# Altium project Robot_Timer_PCB.PrjPcb
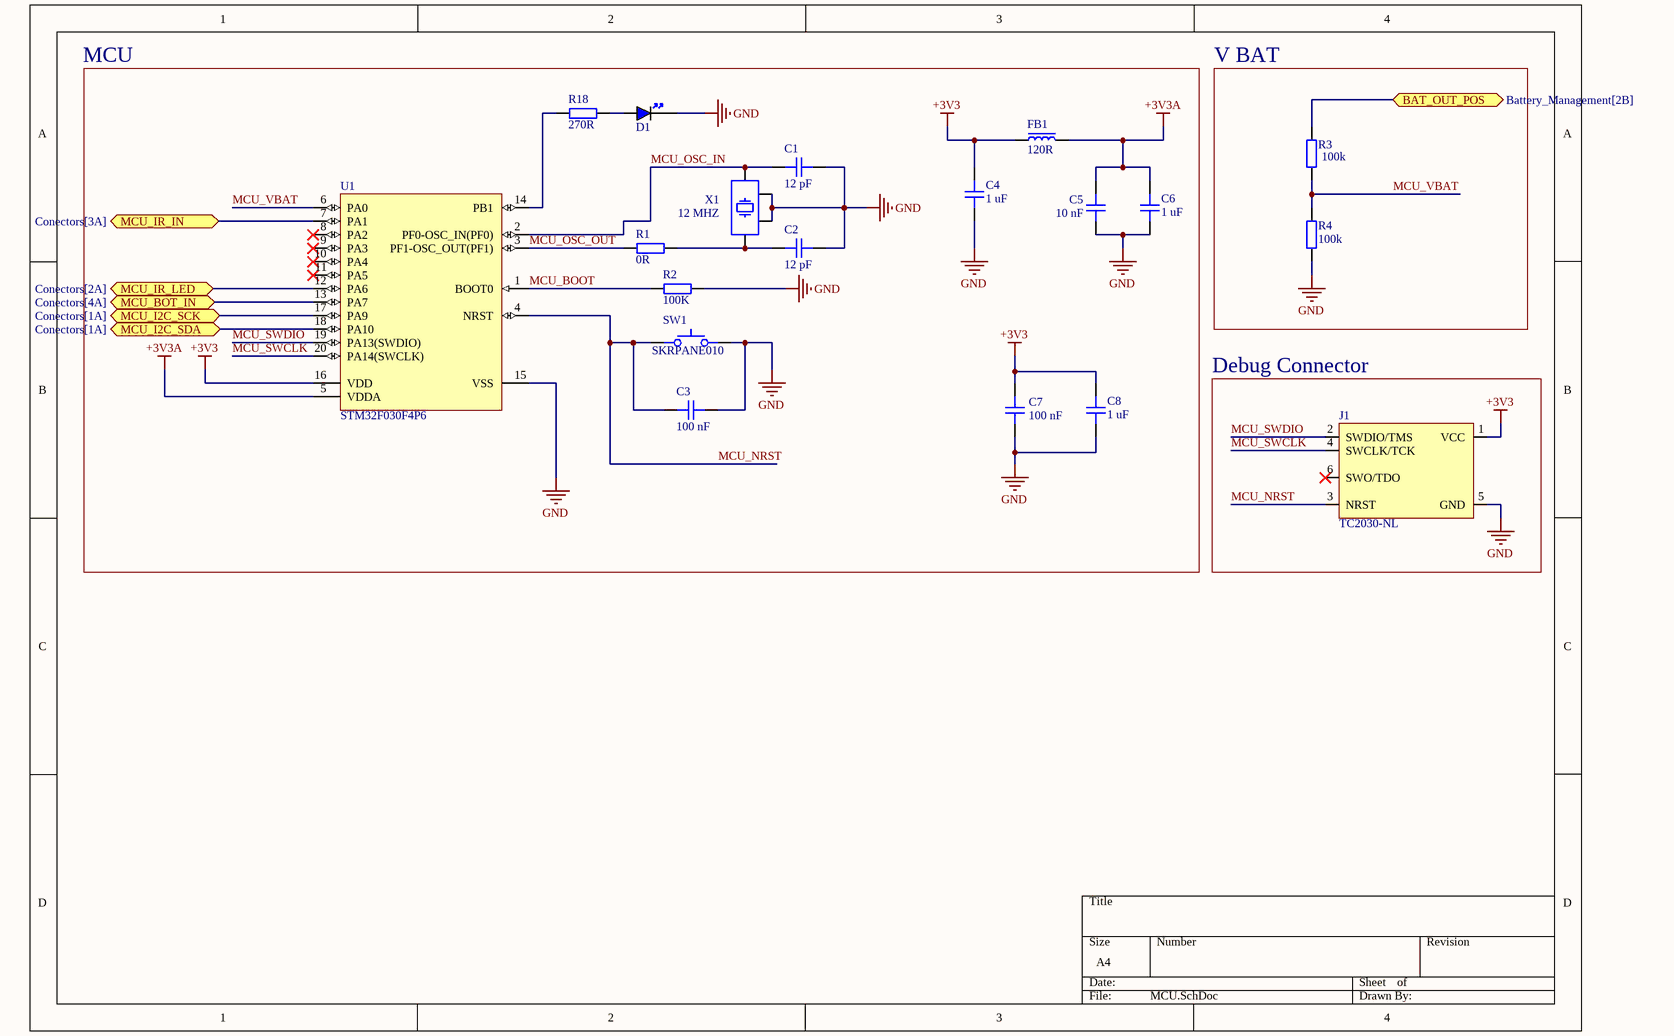
[diagram p0: MCU.SchDoc]
3 sheets, 59 parts. Net scope: flat (ports and power ports of the same name join across sheets).
Board files: PCB1.PcbDoc, PCB2.PcbDoc
Sheets:
  MCU.SchDoc
  Battery_Management.SchDoc
  Conectors.SchDoc

## Sheet MCU.SchDoc
size A4; SheetNumber: 1; SheetTotal: 3

### Parts
C1  12 pF  [CAP_0402]
C2  12 pF  [CAP_0402]
C3  100 nF  [CAP_0402]
C4  1 uF  [CAP_0805]
C5  10 nF  [CAP_0402]
C6  1 uF  [CAP_0805]
C7  100 nF  [CAP_0402]
C8  1 uF  [CAP_0805]
D1  BLUE  [LED_0805_BLUE]  (value not drawn)
FB1  120R  [FB_0805]
J1  TC2030-NL  [TC2030-NL-FP]  (no BOM)
R1  0R  [RES_0402]
R2  100K  [RES_0402]
R3  100k  [RES_0603]
R4  100k  [RES_0603]
R18  270R  [RES_0402]
SW1  SKRPANE010  [SKRPANE010]
U1  STM32F030F4P6  [STM-TSSOP20_L]
X1  12 MHZ  [XTAL_2520]

### Blocks framed on the sheet
MCU: C1-C8 D1 FB1 R1 R2 R18 SW1 U1 X1
V BAT: R3 R4
Debug Connector: J1

### Ports
BAT_OUT_POS (bidir, see Battery_Management[2B]), MCU_BOT_IN (bidir, see Conectors[4A]), MCU_I2C_SCK (bidir, see Conectors[1A]), MCU_I2C_SDA (bidir, see Conectors[1A]), MCU_IR_IN (bidir, see Conectors[3A]), MCU_IR_LED (bidir, see Conectors[2A])

### Nets
+3V3: C4.2 C7.2 C8.2 FB1.1 J1.1(VCC) U1.16(VDD)
+3V3A: C5.2 C6.2 FB1.2 U1.5(VDDA)
GND: C1.2 C2.2 C3.2 C4.1 C5.1 C6.1 C7.1 C8.1 D1.K J1.5(GND) R2.2 R4.1 SW1.34 U1.15(VSS) X1.2 X1.4
MCU_BOOT: R2.1 U1.1(BOOT0)
MCU_I2C_SDA: U1.18(PA10) ; port MCU_I2C_SDA
MCU_NRST: C3.1 J1.3(NRST) SW1.12 U1.4(NRST)
MCU_OSC_IN: C1.1 U1.2(PF0-OSC_IN(PF0)) X1.3
MCU_OSC_OUT: R1.1 U1.3(PF1-OSC_OUT(PF1))
MCU_SWCLK: J1.4(SWCLK/TCK) U1.20(PA14(SWCLK))
MCU_SWDIO: J1.2(SWDIO/TMS) U1.19(PA13(SWDIO))
MCU_VBAT: R3.1 R4.2 U1.6(PA0)
NetC2_1: C2.1 R1.2 X1.1
NetC11_1: R3.2 ; port BAT_OUT_POS
NetD1_A: D1.A R18.2
NetJ6_1: U1.13(PA7) ; port MCU_BOT_IN
NetP1_2: U1.17(PA9) ; port MCU_I2C_SCK
NetP2_3: U1.7(PA1) ; port MCU_IR_IN
NetR16_1: U1.12(PA6) ; port MCU_IR_LED
NetR18_1: R18.1 U1.14(PB1)

Not connected (* = marked no-connect by the designer): J1 6(SWO/TDO)*; U1 8(PA2)* 9(PA3)* 10(PA4)* 11(PA5)*

### Notes on the sheet
- THIS DOCUMENT AND THE DATA DISCLOSED HEREIN OR
- HEREWITH IS THE PROPERTY OF ALTIUM LIMITED AND MAY
- DWG NO:
- REVISION
- REV:
- DESCRIPTION
- DATE
- APPROVED
- BE FREELY DISTRIBUTED IN WHOLE. NO RIGHTS ARE
- RESERVED OR EXPRESS OR IMPLIED WARANTEE GIVEN.
- ENG:
- APPROVALS
- PROJECT
- DSN:
- CHK:
- REFERENCE DOCUMENTS
- PROJECT REVISION:
- TITLE
- DOCUMENT REVISION:
- DESIGN ITEM:
- BOM:
- FAB DWG:
- PCB DWG:
- ASSY DWG:
- SCALE:
- A3
- SIZE
- CAGE CODE
- FILE NAME
- DWG NO.
- SHEET
- OF
- REV

### Library data of the parts
C1-C3 C5 C7 = CAP_0402: Capacitor SMD 0402; Manufacturer: *; Manufacturer Part Number: *; Distributor Link: *; LCSC: *; Rating: *; Dielectric: *
C4 C6 C8 = CAP_0805: Capacitor SMD 0805; Manufacturer: *; Manufacturer Part Number: *; Distributor Link: *; LCSC: *; Rating: *; Dielectric: *
D1 = LED_0805_BLUE: LED 0805 BLUE SMD; Manufacturer: *; Manufacturer Part Number: *; Distributor Link: *; LCSC: *
FB1 = FB_0805: Ferrite Bead SMD 0805GZ2012D121TF; Manufacturer Part Number: PZ2012D121-3R0TF; Manufacturer: *; Distributor Link: *; LCSC: *
J1 = TC2030-NL: Tag-Connect No-Solder SWD Debug Connector (No Legs) DO NOT PLACE; Manufacturer: Tag-Connect; Manufacturer Part Number: TC2030-NL-FP
R1 R2 R18 = RES_0402: Resistor SMD 0402; Manufacturer: *; Manufacturer Part Number: *; Distributor Link: *; LCSC: *
R3 R4 = RES_0603: Resistor SMD 0603; Manufacturer: *; Manufacturer Part Number: *; Distributor Link: *; LCSC: *
SW1 = SKRPANE010: Tactile Switch SMD SPST; Manufacturer: Alps Alpine; Manufacturer Part Number: SKRPANE010
U1 = CMP-0304-00039-2: ARM Cortex-M0 32-bit MCU, 16 KB Flash, 4 KB Internal RAM, 15 I/Os, 20-pin TSSOP, -40 to 85 degC, Tube; I/Os (High Current): 15; FLASH Size (Prog) (kB): 16; Internal RAM Size (kB): 4; Supply Voltage(Vcc) min (V): 2.4; Operating Frequency(F) (Processor speed) (MHz): 48; ComponentLink2URL: http://www.st.com/st-web-ui/static/active/en/resource/technical/document/datasheet/DM00088500.pdf; Core: ARM Cortex-M0; ComponentLink2Description: Datasheet; PackageDescription: 20-Pin Thin Shrink Small Outline Package, 6.5 x 4.4 mm Body, 0.65 mm Pitch; Mounting Technology: Surface Mount; ComponentLink1URL: http://www.st.com/web/en/home.html; PackageVersion: Rev. 1, 11/2012; ComponentLink3Description: Package Specification; PartNumber: STM32F030F4P6; ComponentLink3URL: http://www.st.com/st-web-ui/static/active/en/resource/technical/document/datasheet/DM00065136.pdf; DatasheetVersion: Rev. 1; PackageReference: TSSOP20; ComponentLink1Description: Manufacturer URL; Packing: Tube
X1 = XTAL_2520: Crystal SMD 2520; Manufacturer Part Number: HY12MSMD2520FA1R30; Distributor Link: *

## Sheet Battery_Management.SchDoc
size A4; SheetNumber: 2; SheetTotal: 3
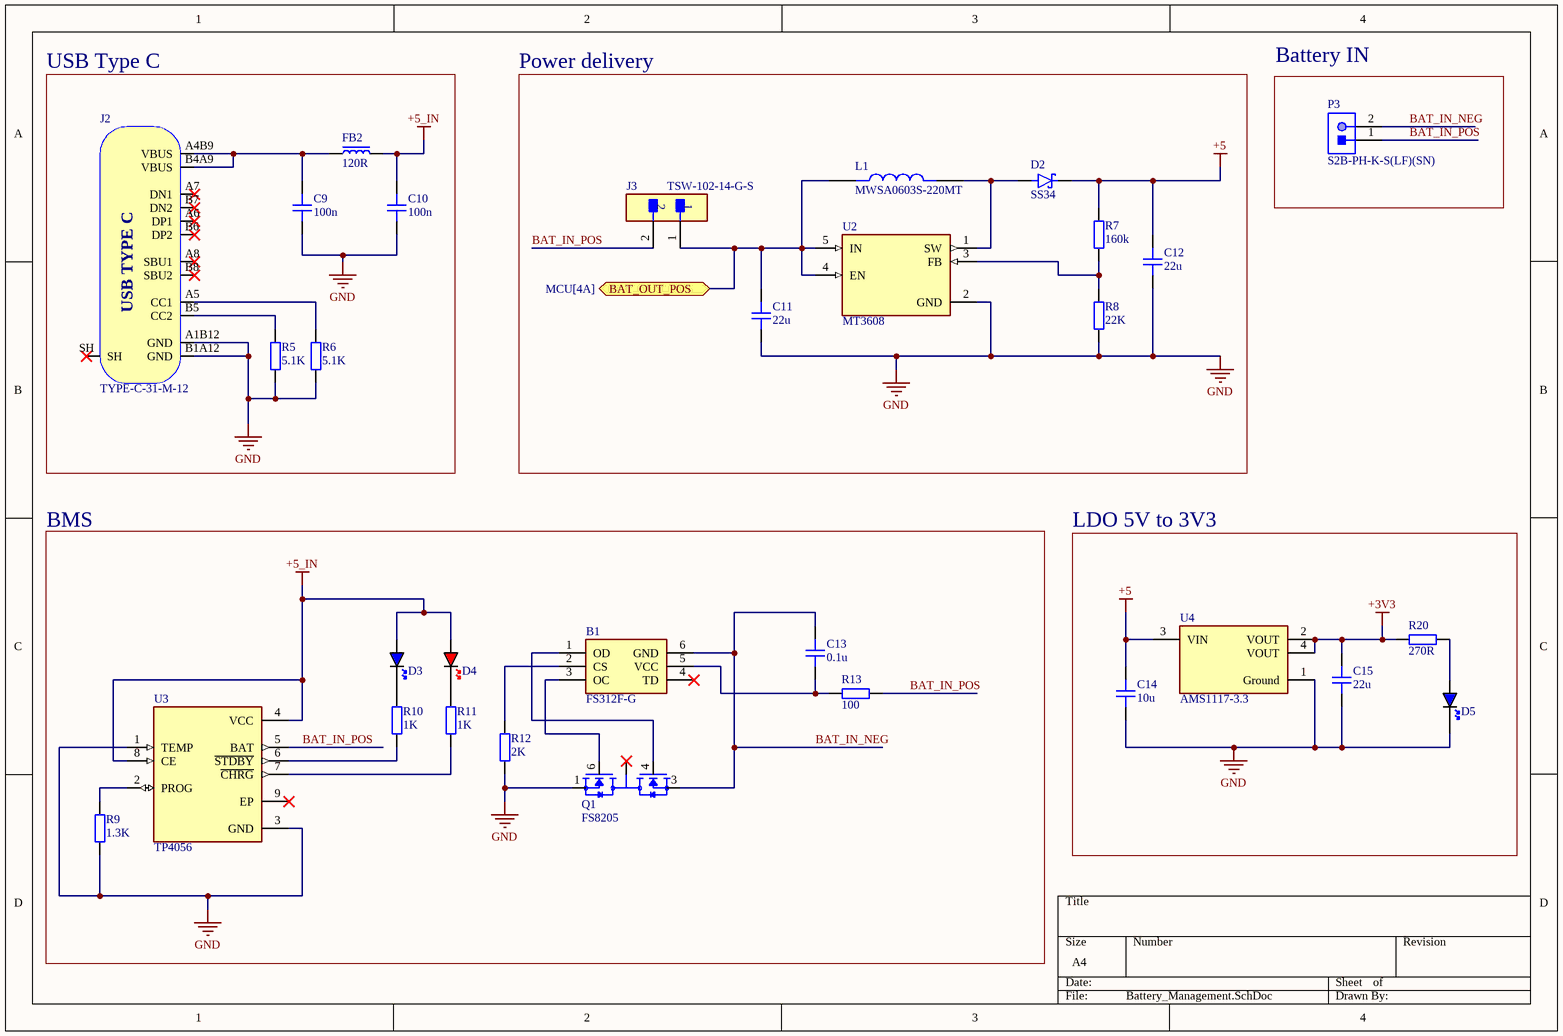
[diagram p1: Battery_Management.SchDoc]

### Parts
B1  FS312F-G  [SOT95P280X145-6N]
C9  100n  [CAP_0603]
C10  100n  [CAP_0603]
C11  22u  [CAP_0603]
C12  22u  [CAP_0603]
C13  0.1u  [CAP_0603]
C14  10u  [CAP_0805]
C15  22u  [CAP_0805]
D2  SS34  [DIO_SS34]
D3  BLUE  [LED_0603_BLUE]  (value not drawn)
D4  RED  [LED_0603_RED]  (value not drawn)
D5  BLUE  [LED_0805_BLUE]  (value not drawn)
FB2  120R  [FB_0805]
J2  TYPE-C-31-M-12  [TYPE-C-31-M-12]
J3  TSW-102-14-G-S  [FP-TSW-102-14-G-S-MFG]
L1  MWSA0603S-220MT  [INDM7066X300N]
P3  S2B-PH-K-S(LF)(SN)  [JST-S2B-PH-K-S_V]
Q1  FS8205  [SOT95P280X145-6N]
R5  5.1K  [RES_0402]
R6  5.1K  [RES_0402]
R7  160k  [RES_0603]
R8  22K  [RES_0603]
R9  1.3K  [RES_0603]
R10  1K  [RES_0603]
R11  1K  [RES_0603]
R12  2K  [RES_0603]
R13  100  [RES_0603]
R20  270R  [RES_0402]
U2  MT3608  [SOT95P280X145-6N]
U3  TP4056  [SOP127P600X175-9N]
U4  AMS1117-3.3  [FP-AMS1117-IPC_C]

### Blocks framed on the sheet
USB Type C: C9 C10 FB2 J2 R5 R6
Power delivery: C11 C12 D2 J3 L1 R7 R8 U2
Battery IN: P3
BMS: B1 C13 D3 D4 Q1 R9-R13 U3
LDO 5V to 3V3: C14 C15 D5 R20 U4

### Ports
BAT_OUT_POS (bidir, see MCU[4A])

### Nets
+3V3: C15.2 R20.1 U4.2(VOUT) U4.4(VOUT)
+5: C12.1 C14.2 D2.C(K) R7.2 U4.3(VIN)
+5_IN: C10.2 D3.A D4.A FB2.2 U3.4(VCC) U3.8(CE)
GND: C9.1 C10.1 C11.2 C12.2 C14.1 C15.1 D5.K J2.A1B12(GND) J2.B1A12(GND) Q1.1(S1) R5.1 R6.1 R8.1 R9.1 R12.1 U2.2(GND) U3.1(TEMP) U3.3(GND) U4.1(Ground)
BAT_IN_NEG: B1.6(GND) C13.1 P3.2 Q1.3(S2)
BAT_IN_POS: J3.2 P3.1 R13.2 U3.5(BAT)
NetB1_1: B1.1(OD) Q1.4(G2)
NetB1_2: B1.2(CS) R12.2
NetB1_3: B1.3(OC) Q1.6(G1)
NetB1_5: B1.5(VCC) C13.2 R13.1
NetC9_2: C9.2 FB2.1 J2.A4B9(VBUS) J2.B4A9(VBUS)
NetC11_1: C11.1 J3.1 L1.1 U2.4(EN) U2.5(IN) ; port BAT_OUT_POS
NetD2_A: D2.A L1.2 U2.1(SW)
NetD3_K: D3.K R10.2
NetD4_K: D4.K R11.2
NetD5_A: D5.A R20.2
NetJ2_A5: J2.A5(CC1) R6.2
NetJ2_B5: J2.B5(CC2) R5.2
NetQ1_2: Q1.2(D12) Q1.5(D12)
NetR7_1: R7.1 R8.2 U2.3(FB)
NetR9_2: R9.2 U3.2(PROG)
NetR10_1: R10.1 U3.6(~{STDBY})
NetR11_1: R11.1 U3.7(~{CHRG})

Not connected (* = marked no-connect by the designer): B1 4(TD)*; J2 A6(DP1)* A7(DN1)* A8(SBU1)* B6(DP2)* B7(DN2)* B8(SBU2)* SH*; U3 9(EP)*

### Notes on the sheet
- (in symbol TYPE-C-31-M-12) USB TYPE C

### Library data of the parts
B1 = FS312F-G: One Cell Lithium-ion/Polymer Battery Protection IC; Manufacturer_Name: Fortune Semiconductor Corporation; Geometry.Height: 1.45mm; Manufacturer_Part_Number: FS312F-G; Mouser Part Number: *; Mouser Price/Stock: *; Arrow Part Number: *; Arrow Price/Stock: *; Datasheet Link: https://www.ic-fortune.com/upload/Download/FS312F-G-DS-12_EN.pdf
C9-C13 = CAP_0603: Capacitor SMD 0603; Manufacturer: *; Manufacturer Part Number: *; Distributor Link: *; LCSC: *; Rating: *; Dielectric: *
C14 C15 = CAP_0805: Capacitor SMD 0805; Manufacturer: *; Manufacturer Part Number: *; Distributor Link: *; LCSC: *; Rating: *; Dielectric: *
D2 = SS34: 3A, 40V, Schottky Rectifier; MF: Taiwan Semiconductor; SnapEDA_Link: https://www.snapeda.com/parts/SS34/Taiwan+Semiconductor/view-part/?ref=snap; Package: DO-214AB-2 Taiwan Semiconductor; Value: *; MP: SS34; Check_prices: https://www.snapeda.com/parts/SS34/Taiwan+Semiconductor/view-part/?ref=eda
D3 = LED_0603_BLUE: LED 0603 BLUE SMD
D4 = LED_0603_RED: LED 0603 RED SMD
D5 = LED_0805_BLUE: LED 0805 BLUE SMD; Manufacturer: *; Manufacturer Part Number: *; Distributor Link: *; LCSC: *
FB2 = FB_0805: Ferrite Bead SMD 0805; Manufacturer Part Number: PZ2012D121-3R0TF; Manufacturer: *; Distributor Link: *; LCSC: *
J2 = TYPE-C-31-M-12: USB Type C Connector Horizontal SMT; Manufacturer: Koren Hroparts; Manufacturer Part Number: TYPE-C-31-M-12
J3 = CMP-02766-001740-1: CONN HEADER VERT 2POS 2.54MM; Number of Positions: 2; Max Current Rating: 7.6A; Gender: Male; Max Voltage Rating (AC): 550V; Contact Mating Length: 0.32inch; REACH SVHC: No SVHC; Width: 2.54mm; Insulation Material: PBT; Contact Shape: Square; Contact Plating: Gold; Min Operating Temperature: -55°C; Contact Material: Bronze; Color: Black; Number of Contacts: 2; Housing Material: Polyester; Orientation: Straight; Flammability Rating: UL94 V-0; Max Operating Temperature: 125°C; Contact Type: Male Pin; Radiation Hardening: No; Termination: Solder; RoHS Compliant: Yes; Lead Free: Lead Free; Fastening Type: Pull; Pitch: 2.54mm; Number of Rows: 1; Series: TSW; Insulation Color: Black; Package Quantity: 1; Connector Type: Header; Length: 5.08mm; Contact Finish - Mating: GOLD; Mount: Through Hole; Housing Color: Black; Depth: 2.54mm; Packaging: Bulk
L1 = MWSA0603S-220MT: 22 ÂµH Unshielded Drum Core, Wirewound Inductor 2.5 A 170mOhm Max Nonstandard -; MF: Shenzhen Sunlord Electronics Co., Ltd.; SnapEDA_Link: https://www.snapeda.com/parts/MWSA0603S-220MT/Shenzhen+Huacan+Tianlu+Electronics+Co.%252C+Ltd./view-part/?ref=snap; Package: None; Value: *; MP: MWSA0603S-220MT; Check_prices: https://www.snapeda.com/parts/MWSA0603S-220MT/Shenzhen+Huacan+Tianlu+Electronics+Co.%252C+Ltd./view-part/?ref=eda
P3 = CMP-1755-00004-1: Male Header, Pitch 2 mm, 1 x 2 Position, Height 4.8 mm, Tail Length 3.4 mm, -25 to 85 degC, RoHS, Bulk; Case\Package: Radial; Tolerance: 20%; Capacitance: 10 uF; Voltage Rating (DC): 50 V; Packaging: Bulk; ComponentLink1URL: http://www.jst-mfg.com/product/pdf/eng/ePH.pdf; Radiation Hardening: No; Height: 11 mm; Package Quantity: 200; PackageDescription: Male Header, Pitch 2 mm, 1 x 2 Position, Height 4.8 mm, Tail Length 3.4 mm; PackageReference: S2B-PH-K-S; Diameter: 5 mm; Pins: 2; Mount: Through Hole; Max Operating Temperature: 85 degC; Min Operating Temperature: -40 degC; ComponentLink1Description: Datasheet; DatasheetVersion: Dec-12; Length: 11 mm; Lead Pitch: 2 mm; REACH SVHC: No SVHC; Voltage Rating: 50 V; RoHSCompliant: true
Q1 = FS8205: ÐœÐžÐŸ-Ñ‚Ñ€Ð°Ð½Ð·Ð¸ÑÑ‚Ð¾Ñ€ Ñ Ð´Ð²Ð¾Ð¹Ð½Ñ‹Ð¼ N-ÐºÐ°Ð½Ð°Ð»ÑŒÐ½Ñ‹Ð¼ Ñ€ÐµÐ¶Ð¸Ð¼Ð¾Ð¼ ÑƒÑÐ¸Ð»ÐµÐ½Ð¸Ñ Ð¼Ð¾Ñ‰Ð½Ð¾ÑÑ‚Ð¸; MF: Fortune Semiconductor; SnapEDA_Link: https://www.snapeda.com/parts/FS8205/Fortune+Semiconductor/view-part/?ref=snap; Package: Package; Value: *; MP: FS8205; Check_prices: https://www.snapeda.com/parts/FS8205/Fortune+Semiconductor/view-part/?ref=eda
R5 R6 R20 = RES_0402: Resistor SMD 0402; Manufacturer: *; Manufacturer Part Number: *; Distributor Link: *; LCSC: *
R7-R13 = RES_0603: Resistor SMD 0603; Manufacturer: *; Manufacturer Part Number: *; Distributor Link: *; LCSC: *
U2 = MT3608: High Efficiency 1.2MHz2A Step Up Converter; MF: Aerosemi Technology Co., Ltd; Price: None; Availability: Not in stock; Package: Package; MP: MT3608; Value: *; SnapEDA_Link: https://www.snapeda.com/parts/MT3608/Aerosemi+Technology+Co.%252C+Ltd/view-part/?ref=snap; Check_prices: https://www.snapeda.com/parts/MT3608/Aerosemi+Technology+Co.%252C+Ltd/view-part/?ref=eda
U3 = TP4056: Complete single cell Li-Ion battery with a constant current / constant voltage linear charger; MF: NanJing Top Power ASIC Corp.; Check_prices: https://www.snapeda.com/parts/TP4056/NanJing+Top+Power+ASIC+Corp./view-part/?ref=eda; SnapEDA_Link: https://www.snapeda.com/parts/TP4056/NanJing+Top+Power+ASIC+Corp./view-part/?ref=snap; Price: None; Availability: Not in stock; Package: Package; MP: TP4056; Value: *
U4 = CMP-209535-000001-1: LDO Voltage Regulators 1A, 3.3V; Manufacturer: Advanced Monolithic Systems; Dropout Voltage: 1.1V; Output Type: Fixed; Nominal Supply Current: 5mA; Max Power Dissipation: 1.2W; Max Supply Voltage: 15V; Number Of Outputs: 1; Standoff Height: 0.64mm; Max Junction Temp: +125°C; Height: 1.8mm; Package: AMS1117; Device Class L2: Power Management ICs; ComponentLink2Description: Datasheet; ComponentLink2URL: http://www.advanced-monolithic.com/pdf/ds1117.pdf; Category: IC; RoHS: TRUE; Automotive: No; Device Class L1: Integrated Circuits (ICs); Output Current: 1A; Device Class L3: Voltage Regulators - Linear; Temperature: -40°C to +125°C; Output Voltage: 3.3V; Manufacturer Part Number: AMS1117-3.3; Temperature Range Low: -40°C; Octopart: https://octopart.com/ams1117-3.3-advanced+monolithic+systems-25899300; Lead Free: Yes; Ipc Land Pattern Name: SOT229P700X180-4; Temperature Range High: +125°C

## Sheet Conectors.SchDoc
size A4; SheetNumber: 3; SheetTotal: 3
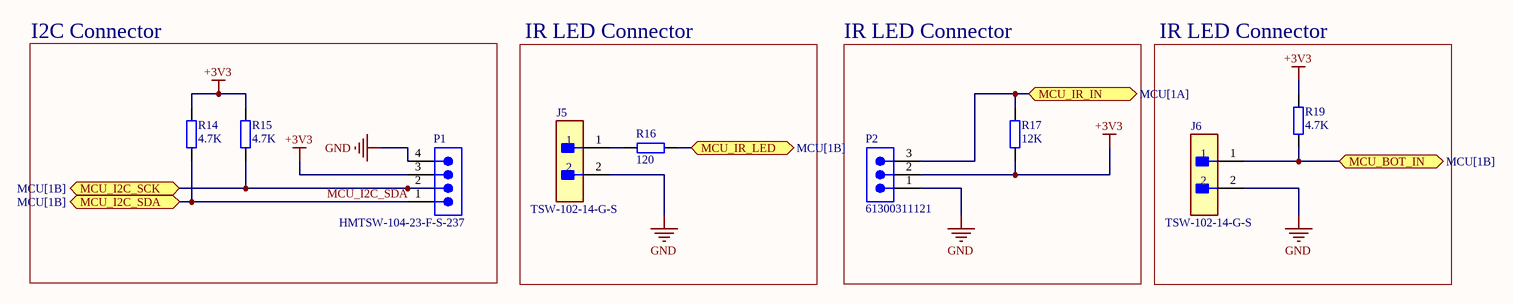
[diagram p2: Conectors.SchDoc]

### Parts
J5  TSW-102-14-G-S  [FP-TSW-102-14-G-S-MFG]
J6  TSW-102-14-G-S  [FP-TSW-102-14-G-S-MFG]
P1  HMTSW-104-23-F-S-237  [SMTC-HMTSW-104-23-X-S-237]
P2  61300311121  [61300311121]
R14  4.7K  [RES_0603]
R15  4.7K  [RES_0603]
R16  120  [RES_0603]
R17  12K  [RES_0603]
R19  4.7K  [RES_0603]

### Blocks framed on the sheet
I2C Connector: P1 R14 R15
IR LED Connector: J5 R16
IR LED Connector: P2 R17
IR LED Connector: J6 R19

### Ports
MCU_BOT_IN (bidir, see MCU[1B]), MCU_I2C_SCK (bidir, see MCU[1B]), MCU_I2C_SDA (bidir, see MCU[1B]), MCU_IR_IN (bidir, see MCU[1A]), MCU_IR_LED (bidir, see MCU[1B])

### Nets
+3V3: P1.3 P2.2 R14.2 R15.2 R17.1 R19.1
GND: J5.2 J6.2 P1.4 P2.1
MCU_I2C_SDA: P1.1 R14.1 ; port MCU_I2C_SDA
NetJ5_1: J5.1 R16.2
NetJ6_1: J6.1 R19.2 ; port MCU_BOT_IN
NetP1_2: P1.2 R15.1 ; port MCU_I2C_SCK
NetP2_3: P2.3 R17.2 ; port MCU_IR_IN
NetR16_1: R16.1 ; port MCU_IR_LED

### Library data of the parts
J5 J6 = CMP-02766-001740-1: as J3 on sheet Battery_Management; Contact Mating Length: 0.32inch; REACH SVHC: No SVHC; Width: 2.54mm; Insulation Material: PBT; Contact Shape: Square; Contact Plating: Gold; Min Operating Temperature: -55°C; Contact Material: Bronze; Color: Black; Number of Contacts: 2; Housing Material: Polyester; Orientation: Straight; Flammability Rating: UL94 V-0; Max Operating Temperature: 125°C; Contact Type: Male Pin; Radiation Hardening: No; Termination: Solder; RoHS Compliant: Yes; Lead Free: Lead Free; Fastening Type: Pull; Pitch: 2.54mm; Number of Rows: 1; Series: TSW; Insulation Color: Black; Package Quantity: 1; Connector Type: Header; Length: 5.08mm; Contact Finish - Mating: GOLD; Mount: Through Hole; Housing Color: Black; Depth: 2.54mm; Packaging: Bulk
P1 = CMP-1024-00021-1: Modified .025" SQ Post Header, Through-hole, Vertical, -55 to 125 degC, 2.54 mm Pitch, 4-Pin, Male, RoHS; Manufacturer: Samtec; Pitch: 2.54 mm; PackageReference: HMTSW-104-23-X-S-237; ComponentLink2URL: http://www.samtec.com/documents/webfiles/pdf/HMTSW.PDF; ComponentLink3Description: Package Specification; PartNumber: HMTSW-104-23-F-S-237; RoHS: True; ComponentLink2Description: Datasheet; Temperature Range: -55 to 125 degC; ComponentLink1Description: Manufacturer URL; DatasheetVersion: F-214; PackageDescription: Assembly .025 [.64] SQ. Post Hi-Temp Terminal Strip; Orientation: Vertical; PackageVersion: AL, 3/1987; Mounting Technology: Through-hole; ComponentLink1URL: http://www.samtec.com; ComponentLink3URL: http://www.samtec.com/documents/webfiles/cpdf/HMTSW-XXX-XX-X-X-XXXX-XX-XX-MKT1.pdf
P2 = CMP-1502-01062-3: NexarPartId: 32855521; Current Rating: 3A; Voltage Rating: 250V; Number of Positions: 3; Pitch: 2.54mm; Contact Resistance: 20mΩ; Connector Type: Male Pin; Gender: Male; REACH SVHC: Unknown; Packaging: Bulk; Contact Material: Copper; Min Operating Temperature: -40°C; Number of Rows: 1; Orientation: Vertical; RoHS: Compliant; Contact Plating: Gold; Max Operating Temperature: 105°C; Mount: Through Hole; Height: 8.94mm; Operating Supply Voltage: 250V; Number of Pins: 3; Contact Mating Length: 5.9944mm; Number of Contacts: 3; Color: Black; Lead Free: Lead Free; Lead Pitch: 2.54mm; Termination: Solder
R14-R17 R19 = RES_0603: Resistor SMD 0603; Manufacturer: *; Manufacturer Part Number: *; Distributor Link: *; LCSC: *

## Nets that join several sheets
+3V3: MCU (6 pins), Battery_Management (C15.2 R20.1 U4.2 U4.4), Conectors (6 pins)
GND: MCU (16 pins), Battery_Management (19 pins), Conectors (J5.2 J6.2 P1.4 P2.1)
MCU_I2C_SDA: MCU (U1.18), Conectors (P1.1 R14.1)
NetC11_1: MCU (R3.2), Battery_Management (5 pins)
NetJ6_1: MCU (U1.13), Conectors (J6.1 R19.2)
NetP1_2: MCU (U1.17), Conectors (P1.2 R15.1)
NetP2_3: MCU (U1.7), Conectors (P2.3 R17.2)
NetR16_1: MCU (U1.12), Conectors (R16.1)